# Altium project RRO26.PrjPcb
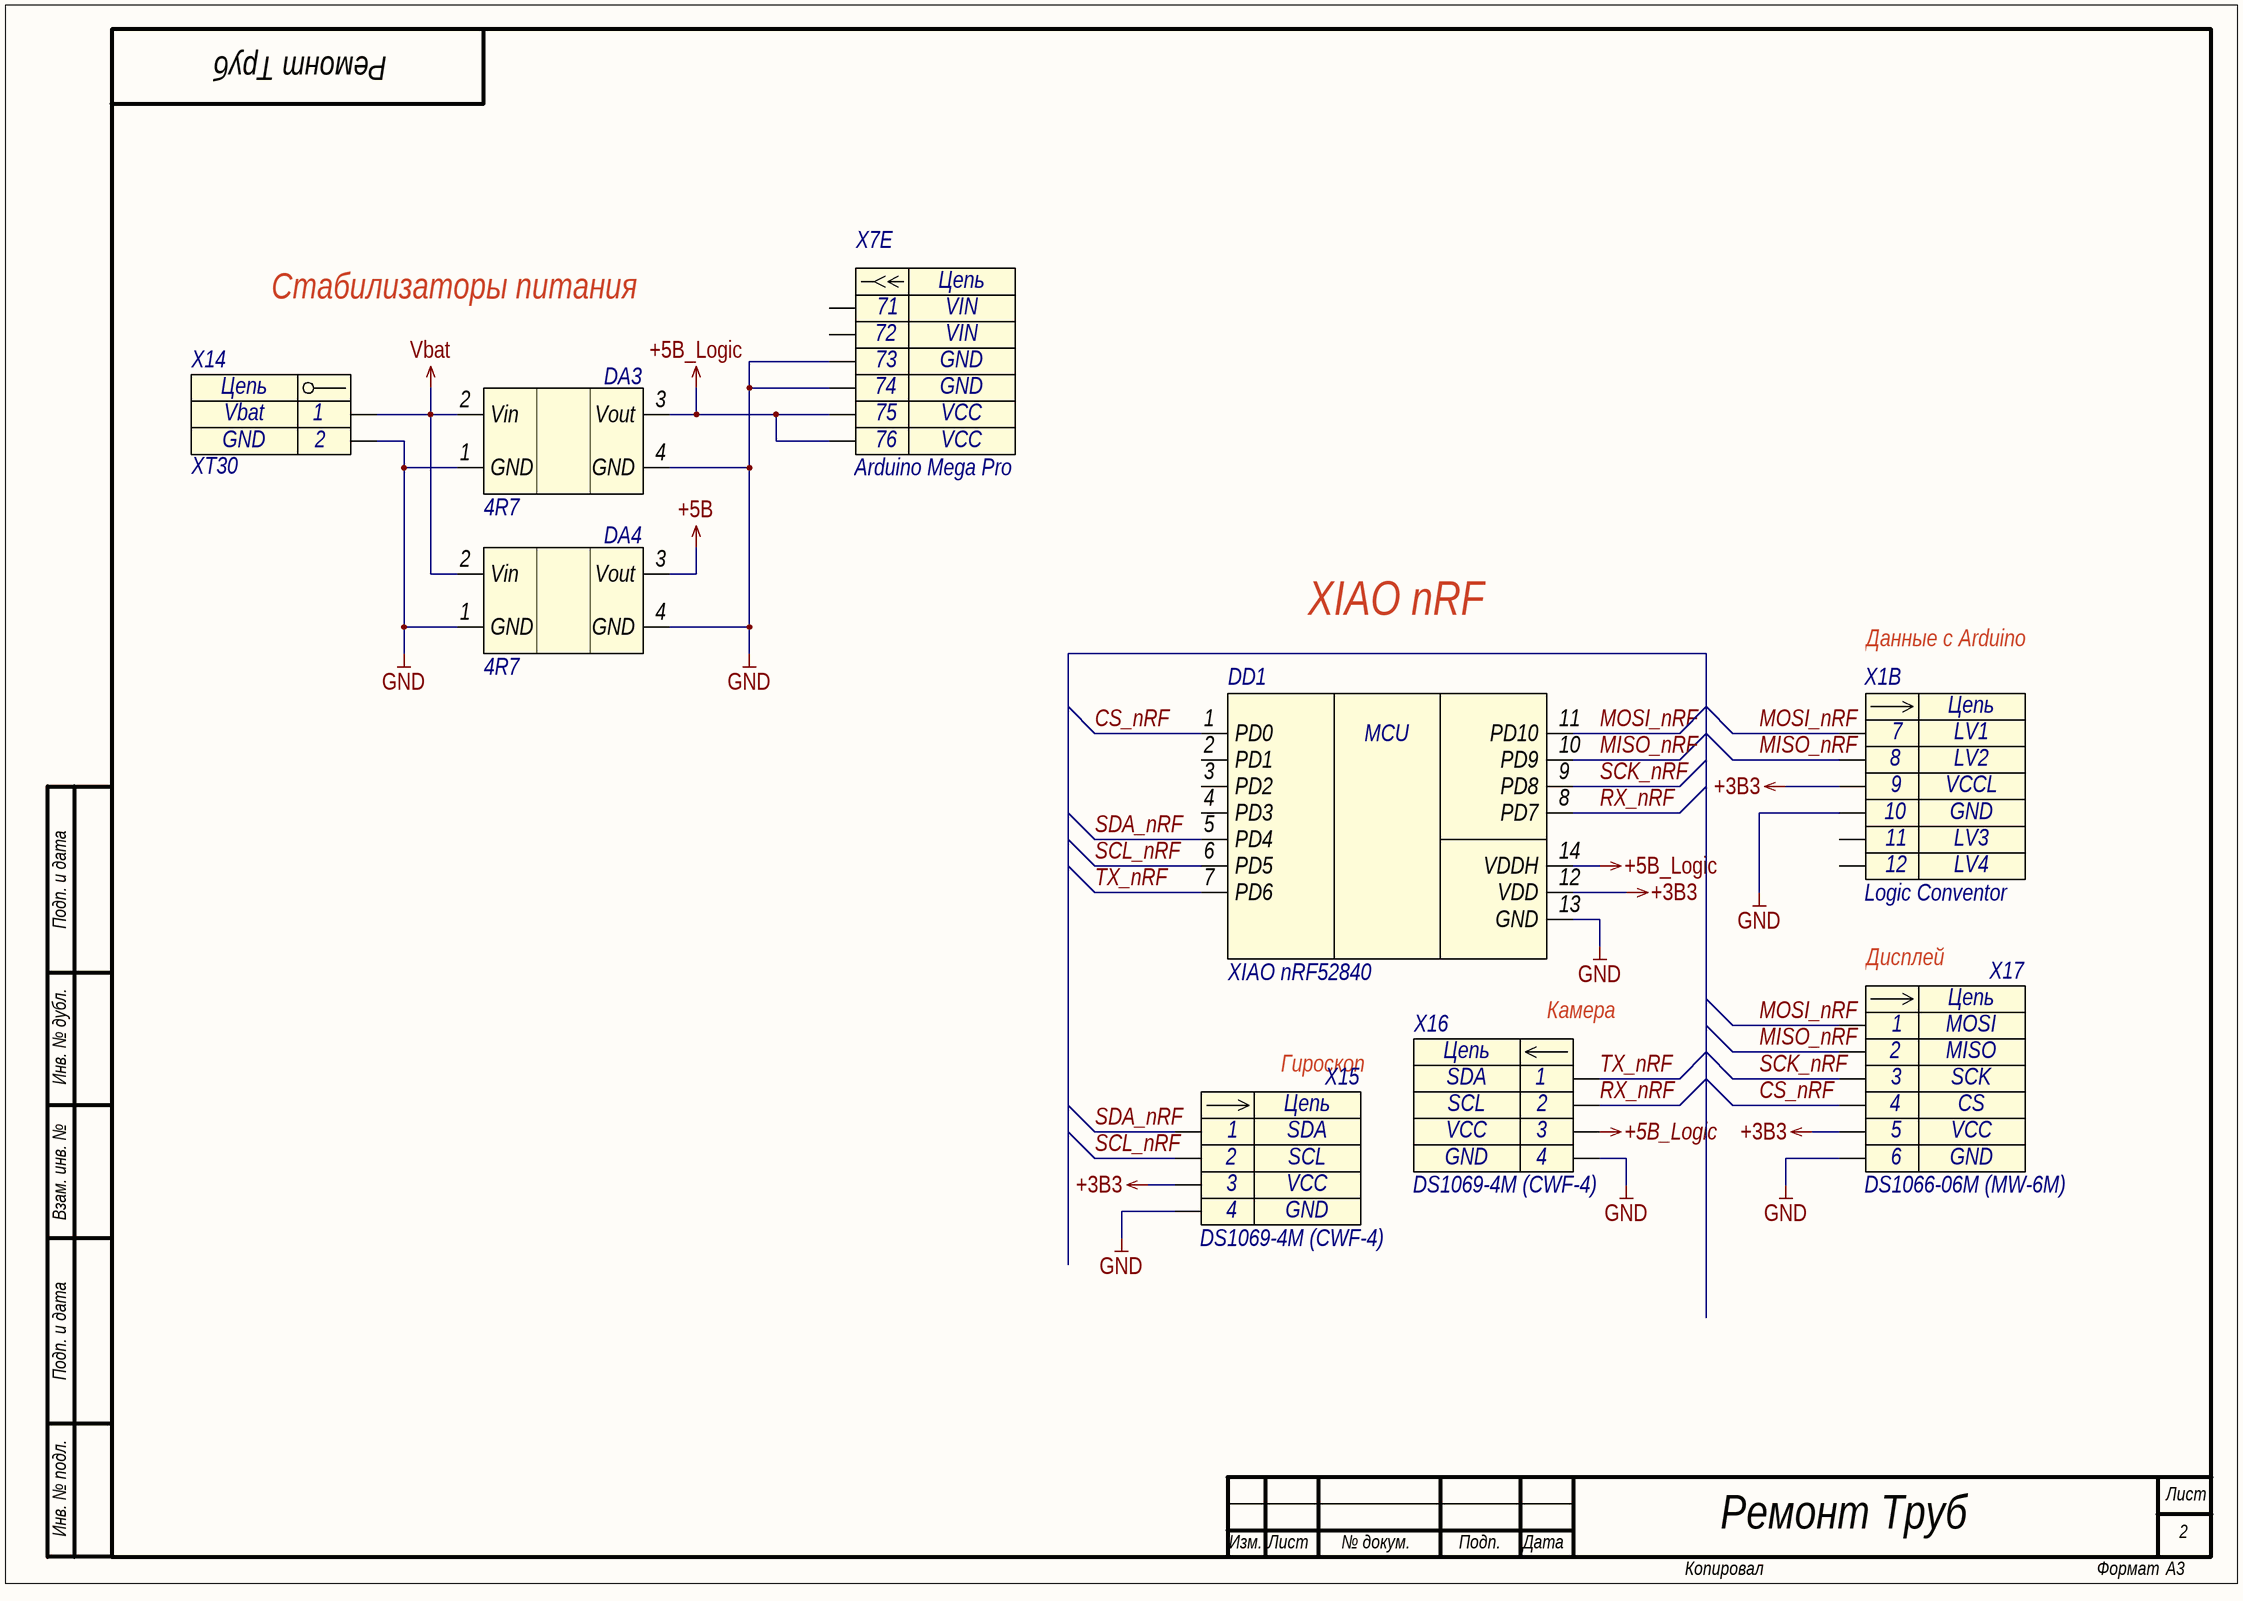
[diagram p0: Э3_2.SchDoc]
2 sheets, 55 parts. Net scope: global (net labels, ports and power ports of the same name join across sheets).
Board file: Плата.PcbDoc
Sheets:
  Э3_2.SchDoc
  Э3_1.SchDoc

## Sheet Э3_2.SchDoc: плата
size 420 x 297 mm; DrawnBy: Каверзнев; DocumentNumber: Ремонт Труб; Revision: 1; SheetNumber: 1; SheetTotal: 2; Format: A3

### Parts
DA3  4R7  [mini360]
DA4  4R7  [mini360]
DD1  XIAO nRF52840  [Seeed Studio XIAO nRF52840]
X1  Logic Conventor  [LOGIC CONVENTOR]  (part B of 2)
X7  Arduino Mega Pro  [Arduino Mega Pro Mini]  (part E of 5)
X14  XT30  [XT30 - duplicate]
X15  DS1069-4M (CWF-4)  [CWF-4]
X16  DS1069-4M (CWF-4)  [CWF-4]
X17  DS1066-06M (MW-6M)  [MW-6M]

### Nets
+3B3: DD1.12(VDD) X1.9 X15.3 X17.5
+5B: DA4.3(Vout)
+5B_Logic: DA3.3(Vout) DD1.14(VDDH) X7.75 X7.76 X16.3
GND: DA3.1(GND) DA3.4(GND) DA4.1(GND) DA4.4(GND) DD1.13(GND) X1.10 X7.73 X7.74 X14.2 X15.4 X16.4 X17.6
Vbat: DA3.2(Vin) DA4.2(Vin) X14.1
CS_nRF: DD1.1(PD0) X17.4
MISO_nRF: DD1.10(PD9) X1.8 X17.2
MOSI_nRF: DD1.11(PD10) X1.7 X17.1
RX_nRF: DD1.8(PD7) X16.2
SCK_nRF: DD1.9(PD8) X17.3
SCL_nRF: DD1.6(PD5) X15.2
SDA_nRF: DD1.5(PD4) X15.1
TX_nRF: DD1.7(PD6) X16.1

Not connected (* = marked no-connect by the designer): DD1 2(PD1) 3(PD2) 4(PD3); X1 11 12; X7 71 72

### Notes on the sheet
- Стабилизаторы питания
- XIAO nRF
- Данные с Arduino
- Подп. и дата
- Дисплей
- Инв. № дубл.
- Камера
- (near X15) Гироскоп
- Взам. инв. №
- Инв. № подл.
- Лист
- 2
- Изм.
- № докум.
- Подп.
- Дата
- Копировал
- Формат
- (in symbol Arduino Mega Pro Mini, part E) Цепь; VIN; GND; VCC
- (in symbol CWF-4) Цепь
- (in symbol Logic Conventor, part B) Цепь; LV1; LV2; VCCL; GND; LV3; LV4
- (in symbol MW-6M) Цепь
- (in symbol XIAO nRF52840) MCU
- (in symbol XT30) Цепь

### Library data of the parts
DA3 DA4 = 4R7: Линейный стабилизатор напряжения 14.4В -> 5В; Manufacturer: China; Name: 4R7
DD1 = XIAO nRF52840: Микроконтроллер nRF52840; Name: XIAO nRF52840; HelpURL: https://wiki.seeedstudio.com/XIAO_BLE/#hardware-overview
X1 = Logic Conventor: Преобразователь уровней; Name: Logic Conventor
X7 = Arduino Mega Pro Mini: Name: Arduino Mega Pro
X14 = XT30: Contact_1: Vbat; Contact_2: GND; Name: XT30
X15 X16 = CWF-4: Разъем - 4 конт. прямая вилка на плату; Contact_1: SDA; Contact_2: SCL; Contact_3: VCC; Contact_4: GND; Name: DS1069-4M (CWF-4)
X17 = MW-6M: Разъем - 6 конт. прямая вилка на плату; Contact_1: MOSI; Contact_2: MISO; Contact_3: SCK; Contact_4: CS; Contact_5: VCC; Contact_6: GND; Name: DS1066-06M (MW-6M)

## Sheet Э3_1.SchDoc: плата
size 420 x 297 mm; DrawnBy: Каверзнев; DocumentNumber: Э3; SheetNumber: 2; SheetTotal: 2; Title1str: Ремонт Труб; DocumentType: схема электрическая принципиальная; Format: A3; ImagePath: 1
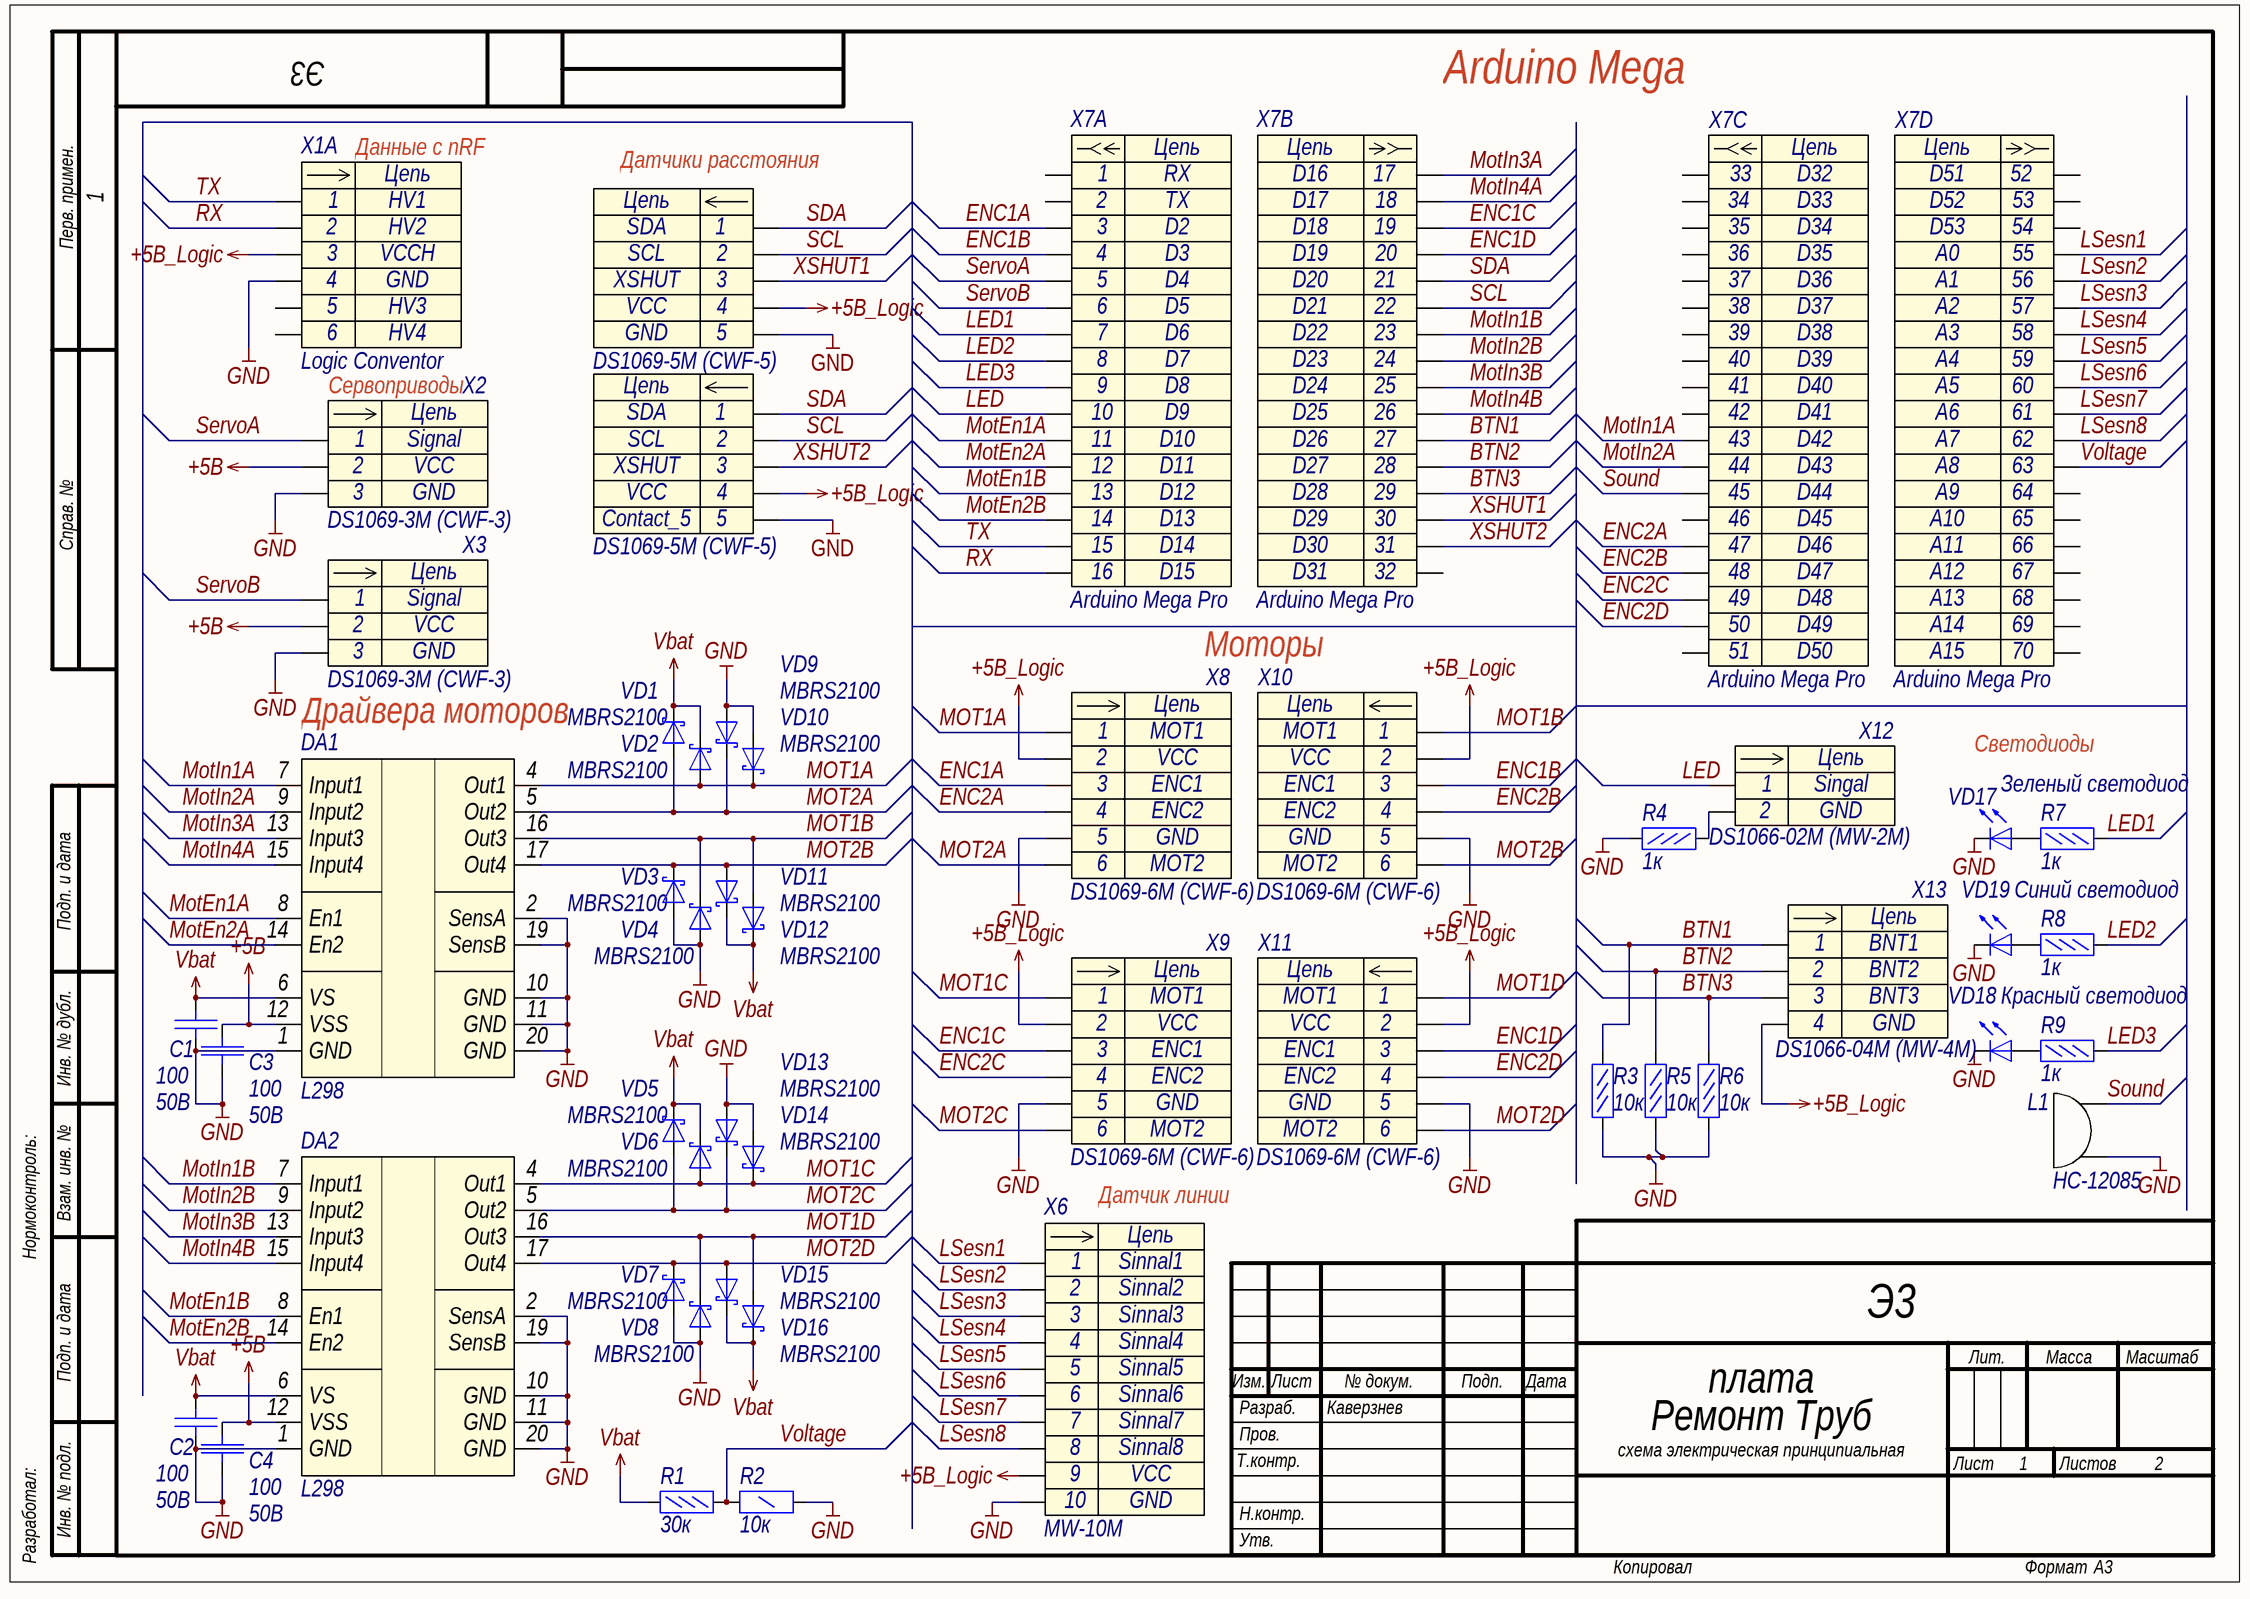
[diagram p1: Э3_1.SchDoc]

### Parts
C1  Voltage: 50В  [C0603]  (hidden comment: 100)
C2  Voltage: 50В  [C0603]  (hidden comment: 100)
C3  Voltage: 50В  [C0603]  (hidden comment: 100)
C4  Voltage: 50В  [C0603]  (hidden comment: 100)
DA1  L298  [L298P]
DA2  L298  [L298P]
L1  HC-12085  [Buzzer]
R1  30к  [R0603]
R2  10к  [R1206]
R3  10к  [R0603]
R4  1к  [R0603]
R5  10к  [R0603]
R6  10к  [R0603]
R7  1к  [R0603]
R8  1к  [R0603]
R9  1к  [R0603]
VD1  MBRS2100  [DO-214AA]
VD2  MBRS2100  [DO-214AA]
VD3  MBRS2100  [DO-214AA]
VD4  MBRS2100  [DO-214AA]
VD5  MBRS2100  [DO-214AA]
VD6  MBRS2100  [DO-214AA]
VD7  MBRS2100  [DO-214AA]
VD8  MBRS2100  [DO-214AA]
VD9  MBRS2100  [DO-214AA]
VD10  MBRS2100  [DO-214AA]
VD11  MBRS2100  [DO-214AA]
VD12  MBRS2100  [DO-214AA]
VD13  MBRS2100  [DO-214AA]
VD14  MBRS2100  [DO-214AA]
VD15  MBRS2100  [DO-214AA]
VD16  MBRS2100  [DO-214AA]
VD17  Зеленый светодиод  [VD0603]
VD18  Красный светодиод  [VD0603]
VD19  Синий светодиод  [VD0603]
X1  Logic Conventor  [LOGIC CONVENTOR]  (part A of 2)
X2  DS1069-3M (CWF-3)  [CWF-3]
X3  DS1069-3M (CWF-3)  [CWF-3]
X4  DS1069-5M (CWF-5)  [CWF-5]
X5  DS1069-5M (CWF-5)  [CWF-5]
X6  MW-10M  [MW-10M]
X7  Arduino Mega Pro  [Arduino Mega Pro Mini]  (parts A,B,C,D of 5)
X8  DS1069-6M (CWF-6)  [CWF-6]
X9  DS1069-6M (CWF-6)  [CWF-6]
X10  DS1069-6M (CWF-6)  [CWF-6]
X11  DS1069-6M (CWF-6)  [CWF-6]
X12  DS1066-02M (MW-2M)  [MW-2M]
X13  DS1066-04M (MW-4M)  [MW-4M]

### Nets
+5B: C3.2 C4.2 DA1.12(VSS) DA2.12(VSS) X2.2 X3.2
+5B_Logic: X1.3 X4.4 X5.4 X6.9 X8.2 X9.2 X10.2 X11.2 X13.4
GND: C1.1 C2.1 C3.1 C4.1 DA1.1(GND) DA1.2(SensA) DA1.10(GND) DA1.11(GND) DA1.19(SensB) DA1.20(GND) DA2.1(GND) DA2.2(SensA) DA2.10(GND) DA2.11(GND) DA2.19(SensB) DA2.20(GND) L1.2 R2.2 R3.1 R4.2 R5.1 R6.1 VD3.2(A) VD4.2(A) VD7.2(A) VD8.2(A) VD9.2(A) VD10.2(A) VD13.2(A) VD14.2(A) VD17.2(K) VD18.2(K) VD19.2(K) X1.4 X2.3 X3.3 X4.5 X5.5 X6.10 X8.5 X9.5 X10.5 X11.5
Vbat: C1.2 C2.2 DA1.6(VS) DA2.6(VS) R1.1 VD1.1(K) VD2.1(K) VD5.1(K) VD6.1(K) VD11.1(K) VD12.1(K) VD15.1(K) VD16.1(K)
BTN1: R3.2 X7.27 X13.1
BTN2: R5.2 X7.28 X13.2
BTN3: R6.2 X7.29 X13.3
ENC1A: X7.3 X8.3
ENC1B: X7.4 X10.3
ENC1C: X7.19 X9.3
ENC1D: X7.20 X11.3
ENC2A: X7.47 X8.4
ENC2B: X7.48 X10.4
ENC2C: X7.49 X9.4
ENC2D: X7.50 X11.4
LED: X7.10 X12.1
LED1: R7.2 X7.7
LED2: R8.2 X7.8
LED3: R9.2 X7.9
LSesn1: X6.1 X7.55
LSesn2: X6.2 X7.56
LSesn3: X6.3 X7.57
LSesn4: X6.4 X7.58
LSesn5: X6.5 X7.59
LSesn6: X6.6 X7.60
LSesn7: X6.7 X7.61
LSesn8: X6.8 X7.62
MOT1A: DA1.4(Out1) VD2.2(A) VD10.1(K) X8.1
MOT1B: DA1.16(Out3) VD4.1(K) VD12.2(A) X10.1
MOT1C: DA2.4(Out1) VD6.2(A) VD14.1(K) X9.1
MOT1D: DA2.16(Out3) VD8.1(K) VD16.2(A) X11.1
MOT2A: DA1.5(Out2) VD1.2(A) VD9.1(K) X8.6
MOT2B: DA1.17(Out4) VD3.1(K) VD11.2(A) X10.6
MOT2C: DA2.5(Out2) VD5.2(A) VD13.1(K) X9.6
MOT2D: DA2.17(Out4) VD7.1(K) VD15.2(A) X11.6
MotEn1A: DA1.8(En1) X7.11
MotEn1B: DA2.8(En1) X7.13
MotEn2A: DA1.14(En2) X7.12
MotEn2B: DA2.14(En2) X7.14
MotIn1A: DA1.7(Input1) X7.15
MotIn1B: DA2.7(Input1) X7.23
MotIn2A: DA1.9(Input2) X7.16
MotIn2B: DA2.9(Input2) X7.24
MotIn3A: DA1.13(Input3) X7.17
MotIn3B: DA2.13(Input3) X7.25
MotIn4A: DA1.15(Input4) X7.18
MotIn4B: DA2.15(Input4) X7.26
RX: X1.2 X7.31
SCL: X4.2 X5.2 X7.22
SDA: X4.1 X5.1 X7.21
ServoA: X2.1 X7.5
ServoB: X3.1 X7.6
Sound: L1.1 X7.45
TX: X1.1 X7.30
Voltage: R1.2 R2.1 X7.43
XSHUT1: X4.3 X7.64
XSHUT2: X5.3 X7.65
NetR4_1: R4.1 X12.2
NetR7_1: R7.1 VD17.1(A)
NetR8_1: R8.1 VD19.1(A)
NetR9_1: R9.1 VD18.1(A)

Not connected (* = marked no-connect by the designer): X1 5 6; X7 1 2 32 33 34 35 36 37 38 39 40 41 42 44 46 51 52 53 54 66 67 68 69 70

### Notes on the sheet
- Arduino Mega
- Перв. примен.
- Данные с nRF
- (near X4) Датчики расстояния
- Сервоприводы
- Справ. №
- Моторы
- Драйвера моторов
- Светодиоды
- Подп. и дата
- Инв. № дубл.
- Нормоконтроль:
- Взам. инв. №
- Датчик линии
- Изм.
- Лист
- № докум.
- Подп.
- Дата
- Лит.
- Масса
- Масштаб
- Т.контр.
- Пров.
- Разраб.
- 1
- Листов
- 2
- Разработал:
- Инв. № подл.
- Н.контр.
- Утв.
- Копировал
- Формат
- (in symbol Arduino Mega Pro Mini, part A) Цепь; RX; TX; D2; D3; D4; D5; D6; D7; D8; D9; D10; D11; D12; D13; 15; D14; 16; D15
- (in symbol Arduino Mega Pro Mini, part B) Цепь; D16; D17; D18; D19; D20; D21; D22; D23; D24; D25; D26; D27; D28; D29; 30; D30; 31; D31; /
- (in symbol Arduino Mega Pro Mini, part C) Цепь; D32; D33; D34; D35; D36; D37; D38; D39; D40; D41; 43; D42; 44; D43; D44; D45; D46; D47; D48; D49; D50
- (in symbol Arduino Mega Pro Mini, part D) Цепь; D51; D52; D53; A0; A1; A2; A3; A4; A5; A6; A7; A8; 63; A9; 64; A10; A11; A12; A13; A14; A15
- (in symbol CWF-3) Цепь
- (in symbol CWF-5) Цепь
- (in symbol CWF-6) Цепь
- (in symbol CWF-10) Цепь
- (in symbol Logic Conventor, part A) Цепь; HV1; HV2; VCCH; GND; HV3; HV4
- (in symbol MW-2M) Цепь
- (in symbol MW-4M) Цепь

### Library data of the parts
C1-C4 = CC0603JRNPO9BN101: Конденсатор кер. 100пФ 50В; Manufacturer: Yageo; TKE: NP0; Name: CC0603JRNPO9BN101; Value: 100
DA1 DA2 = L298: Драйвер двигателя; Manufacturer: China; Name: L298
L1 = HC-12085: Manufacturer: Epcos TDK; Name: HC-12085
R1 = RC0603FR-0730KL: Резистор 30кОм 0,063Вт 1%; Manufacturer: YAGEO; Name: RC0603FR-0730KL; Tolerance: 1%; Value: 30к
R2 = RC1206FR-0710KL: Резистор 10к 0,25Вт 1%; Manufacturer: YAGEO; Name: RC1206FR-07180KL; Value: 10к
R3 R5 R6 = RC0603FR-0710KL: Резистор 10кОм 0,063Вт 1%; Manufacturer: YAGEO; Name: RC0603FR-0710KL; Tolerance: 1%; Value: 10к
R4 R7-R9 = RC0603FR-071KL: Резистор 1кОм 0,063Вт 1%; Manufacturer: YAGEO; Name: RC0603FR-071KL; Tolerance: 1%; Value: 1к
VD1-VD16 = MBRS2100: Диод Шоттки 100В 2А; Name: MBRS2100
VD17 = FYLS-0603BUGC: Светодтод зеленый SMD Foryard Optoelectronics Co.; Name: Зеленый светодиод
VD18 = FYLS-0603BURC: Светодтод красный SMD Foryard Optoelectronics Co.; Name: Красный светодиод
VD19 = FYLS-0603BUBC: Светодтод синий SMD Foryard Optoelectronics Co.; Name: Синий светодиод
X1 = Logic Conventor: Преобразователь уровней; Name: Logic Conventor
X2 X3 = CWF-3: Разъем - 3 конт. прямая вилка на плату; Contact_1: Signal; Contact_2: VCC; Contact_3: GND; Name: DS1069-3M (CWF-3)
X4 = CWF-5: Разъем - 5 конт. прямая вилка на плату; Contact_1: SDA; Contact_2: SCL; Contact_3: XSHUT; Contact_4: VCC; Contact_5: GND; Contact_6: Contact_6; Name: DS1069-5M (CWF-5)
X5 = CWF-5: Разъем - 5 конт. прямая вилка на плату; Contact_1: SDA; Contact_2: SCL; Contact_3: XSHUT; Contact_4: VCC; Contact_5: Contact_5; Contact_6: Contact_6; Name: DS1069-5M (CWF-5)
X6 = CWF-10: Contact_1: Sinnal1; Contact_2: Sinnal2; Contact_3: Sinnal3; Contact_4: Sinnal4; Contact_5: Sinnal5; Contact_6: Sinnal6; Contact_7: Sinnal7; Contact_8: Sinnal8; Contact_9: VCC; Contact_10: GND; Name: MW-10M
X7 = Arduino Mega Pro Mini: Name: Arduino Mega Pro
X8-X11 = CWF-6: Разъем - 6 конт. прямая вилка на плату; Contact_1: MOT1; Contact_2: VCC; Contact_3: ENC1; Contact_4: ENC2; Contact_5: GND; Contact_6: MOT2; Name: DS1069-6M (CWF-6)
X12 = MW-2M: Разъем - 2 конт. прямая вилка на плату; Contact_1: Singal; Contact_2: GND; Name: DS1066-02M (MW-2M)
X13 = MW-4M: Разъем - 4 конт. прямая вилка на плату; Contact_1: BNT1; Contact_2: BNT2; Contact_3: BNT3; Contact_4: GND; Name: DS1066-04M (MW-4M)

## Nets that join several sheets
+5B: Э3_2 (DA4.3), Э3_1 (6 pins)
+5B_Logic: Э3_2 (5 pins), Э3_1 (9 pins)
GND: Э3_2 (12 pins), Э3_1 (43 pins)
Vbat: Э3_2 (DA3.2 DA4.2 X14.1), Э3_1 (13 pins)